# Altium schematic sheet CH340G.SchDoc
size A4
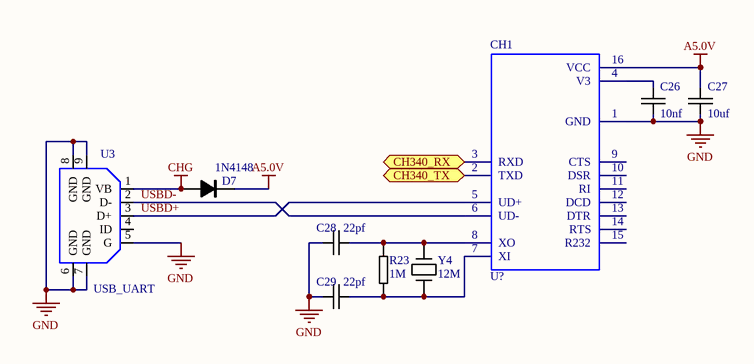
[diagram p0: CH340G.SchDoc]

## Parts
C26  10nf  [0603]
C27  10uf  [0603]
C28  22pf  [0603]
C29  22pf  [0603]
CH1  U?  [SOP-16(230)]
D7  1N4148  [DO-35]
R23  1M  [0603]
U3  USB_UART  [USB_Mini_B]
Y4  12M  [XTAL(HC-49)]

## Ports
CH340_RX, CH340_TX

## Nets
A5.0V: C27.1 CH1.16(VCC) D7.2(K)
CHG: D7.1(A) U3.1(VB)
GND: C26.2 C27.2 C28.1 C29.1 CH1.1(GND) U3.5(G) U3.6(GND) U3.7(GND) U3.8(GND) U3.9(GND)
CH340_RX: CH1.3(RXD) ; port CH340_RX
CH340_TX: CH1.2(TXD) ; port CH340_TX
USBD+: CH1.5(UD+) U3.3(D+)
USBD-: CH1.6(UD-) U3.2(D-)
NetC26_1: C26.1 CH1.4(V3)
NetC28_2: C28.2 CH1.8(XO) R23.1 Y4.1
NetC29_2: C29.2 CH1.7(XI) R23.2 Y4.2

Not connected (* = marked no-connect by the designer): CH1 9(CTS) 10(DSR) 11(RI) 12(DCD) 13(DTR) 14(RTS) 15(R232); U3 4(ID)

## Library data of the parts
C26-C29 = CAP_Chip: 贴片
CH1 = CH340G: USB-TTL芯片
D7 = 1N4148(DO-35): 1.04.08.0001
R23 = RES_Chip: 贴片
U3 = USB_Mini_B
Y4 = XTAL(12.000M,HC-49US): 1.07.02.0011